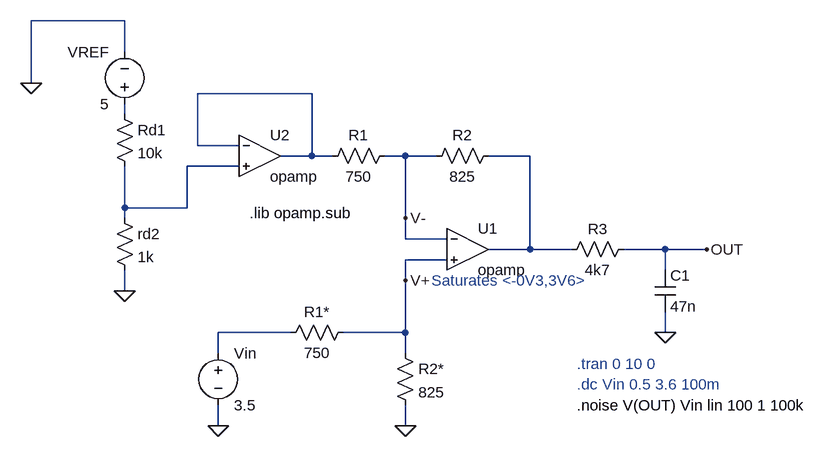
[diagram p0: schematic Scaling_circuit.asc]
Scaling_circuit.asc, the LTspice schematic file:
Version 4
SHEET 1 1596 680
WIRE -336 -208 -480 -208
WIRE -336 -160 -336 -208
WIRE -480 -112 -480 -208
WIRE -48 -96 -224 -96
WIRE -336 -64 -336 -80
WIRE -224 -16 -224 -96
WIRE -160 -16 -224 -16
WIRE -48 0 -48 -96
WIRE -48 0 -96 0
WIRE -16 0 -48 0
WIRE 96 0 64 0
WIRE 144 0 96 0
WIRE 288 0 224 0
WIRE -160 16 -240 16
WIRE -336 80 -336 16
WIRE -240 80 -240 16
WIRE -240 80 -336 80
WIRE -336 96 -336 80
WIRE 96 96 96 0
WIRE 96 128 96 96
WIRE 160 128 96 128
WIRE 288 144 288 0
WIRE 288 144 224 144
WIRE 352 144 288 144
WIRE 496 144 432 144
WIRE 560 144 496 144
WIRE 160 160 96 160
WIRE 496 176 496 144
WIRE 96 192 96 160
WIRE -336 208 -336 176
WIRE -80 272 -192 272
WIRE 96 272 96 192
WIRE 96 272 0 272
WIRE 496 272 496 240
WIRE -192 304 -192 272
WIRE 96 304 96 272
WIRE -192 416 -192 384
WIRE 96 416 96 384
FLAG -480 -112 0
FLAG 96 416 0
FLAG -192 416 0
FLAG -336 208 0
FLAG 96 192 V+
FLAG 96 96 V-
FLAG 560 144 OUT
FLAG 496 272 0
SYMBOL OpAmps\\opamp 192 80 R0
SYMATTR InstName U1
SYMBOL voltage -336 -64 R180
WINDOW 0 24 96 Left 2
WINDOW 3 24 16 Left 2
SYMATTR InstName VREF
SYMATTR Value 5
SYMBOL voltage -192 288 R0
WINDOW 123 0 0 Left 0
WINDOW 39 0 0 Left 0
SYMATTR InstName Vin
SYMATTR Value 3.5
SYMBOL res 80 -16 R90
WINDOW 0 0 56 VBottom 2
WINDOW 3 32 56 VTop 2
SYMATTR InstName R1
SYMATTR Value 750
SYMBOL res 240 -16 R90
WINDOW 0 0 56 VBottom 2
WINDOW 3 32 56 VTop 2
SYMATTR InstName R2
SYMATTR Value 825
SYMBOL res 80 288 R0
SYMATTR InstName R2*
SYMATTR Value 825
SYMBOL res 16 256 R90
WINDOW 0 0 56 VBottom 2
WINDOW 3 32 56 VTop 2
SYMATTR InstName R1*
SYMATTR Value 750
SYMBOL OpAmps\\opamp -128 -64 R0
SYMATTR InstName U2
SYMBOL res -352 -80 R0
SYMATTR InstName Rd1
SYMATTR Value 10k
SYMBOL res -352 80 R0
SYMATTR InstName rd2
SYMATTR Value 1k
SYMBOL cap 480 176 R0
SYMATTR InstName C1
SYMATTR Value 47n
SYMBOL res 448 128 R90
WINDOW 0 0 56 VBottom 2
WINDOW 3 32 56 VTop 2
SYMATTR InstName R3
SYMATTR Value 4k7
TEXT -144 88 Left 2 !.lib opamp.sub
TEXT 360 320 Left 2 ;.tran 0 10 0
TEXT 360 352 Left 2 ;.dc Vin 0.5 3.6 100m
TEXT 136 192 Left 2 ;Saturates <-0V3,3V6>
TEXT 360 384 Left 2 !.noise V(OUT) Vin lin 100 1 100k

The netlist it stands for:
* Scaling_circuit.asc
XU1 V- V+ N003 opamp Aol=100K GBW=10Meg  ; pins invin noninvin out
VREF N002 0 5
Vin N005 0 3.5
R1 V- N001 750
R2 N003 V- 825
R2* V+ 0 825
R1* V+ N005 750
XU2 N001 N004 N001 opamp Aol=100K GBW=10Meg  ; pins invin noninvin out
Rd1 N002 N004 10k
rd2 N004 0 1k
C1 OUT 0 47n
R3 OUT N003 4k7
.lib opamp.sub
* .tran 0 10 0
* .dc Vin 0.5 3.6 100m
* Saturates <-0V3,3V6>
.noise V(OUT) Vin lin 100 1 100k
.backanno
.end